# Altium schematic sheet new_controller.SchDoc
size A2
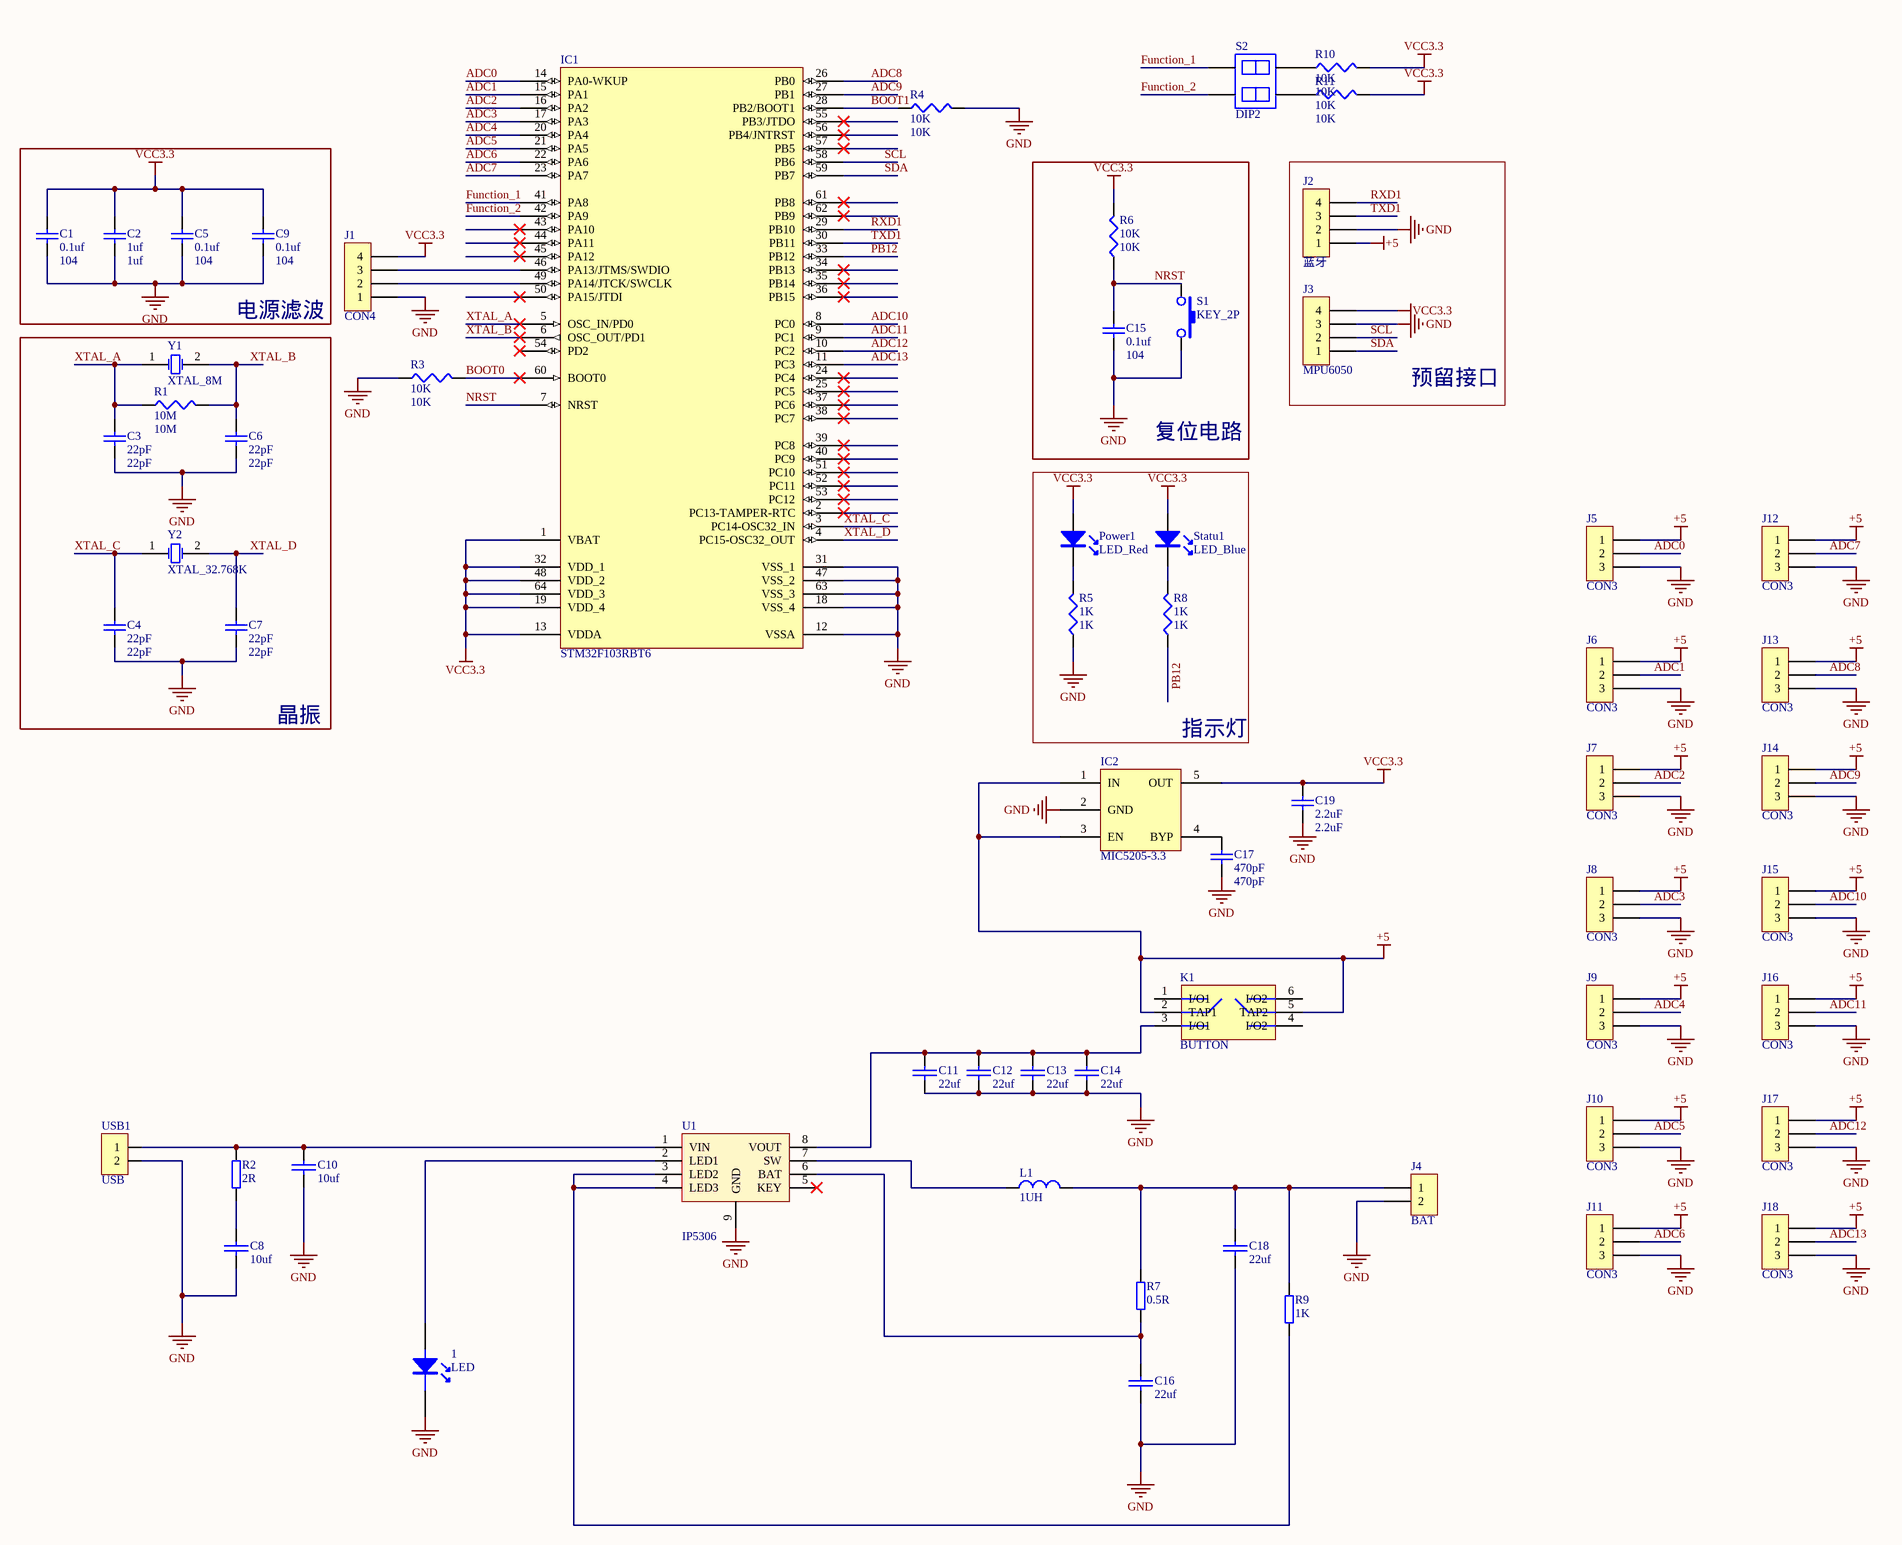
[diagram p0: new_controller.SchDoc]

## Parts
1  LED  [6-0805_L]
C1  0.1uf  value 104  [6-0805_L]
C2  1uf  [6-0805_L]
C3  22pF  [6-0805_L]
C4  22pF  [6-0805_L]
C5  0.1uf  value 104  [6-0805_L]
C6  22pF  [6-0805_L]
C7  22pF  [6-0805_L]
C8  10uf  [6-0805_L]
C9  0.1uf  value 104  [6-0805_L]
C10  10uf  [6-0805_L]
C11  22uf  [6-0805_L]
C12  22uf  [6-0805_L]
C13  22uf  [6-0805_L]
C14  22uf  [6-0805_L]
C15  0.1uf  value 104  [6-0805_L]
C16  22uf  [6-0805_L]
C17  470pF  [6-0805_L]
C18  22uf  [6-0805_L]
C19  2.2uF  [6-0805_L]
IC1  STM32F103RBT6  [LQFP64_N]
IC2  MIC5205-3.3  [SOT-23-5]
J1  CON4  [HDR1X4]
J2  蓝牙  [HDR1X4]
J3  MPU6050  [HDR1X4]
J4  BAT  [接线座2P]
J5  CON3  [XH2.54-3P]
J6  CON3  [XH2.54-3P]
J7  CON3  [XH2.54-3P]
J8  CON3  [XH2.54-3P]
J9  CON3  [XH2.54-3P]
J10  CON3  [XH2.54-3P]
J11  CON3  [XH2.54-3P]
J12  CON3  [XH2.54-3P]
J13  CON3  [XH2.54-3P]
J14  CON3  [XH2.54-3P]
J15  CON3  [XH2.54-3P]
J16  CON3  [XH2.54-3P]
J17  CON3  [XH2.54-3P]
J18  CON3  [XH2.54-3P]
K1  BUTTON  [switch]
L1  1UH  [0630电感]
Power1  LED_Red  [6-0805_M]
R1  10M  [6-0805_L]
R2  2R  [6-0805_L]
R3  10K  [6-0805_L]
R4  10K  [6-0805_L]
R5  1K  [6-0805_L]
R6  10K  [6-0805_L]
R7  0.5R  [6-0805_L]
R8  1K  [6-0805_L]
R9  1K  [6-0805_L]
R10  10K  [6-0805_L]
R11  10K  [6-0805_L]
S1  KEY_2P  [button]
S2  DIP2  [DIP2]
Statu1  LED_Blue  [6-0805_M]
U1  IP5306  [ESOP8]
USB1  USB  [Type-C]
Y1  XTAL_8M  [xtal]
Y2  XTAL_32.768K  [R38]

## Blocks framed on the sheet
电源滤波: C1 C2 C5 C9
复位电路: C15 R6 S1
预留接口: J2 J3
晶振: C3 C4 C6 C7 R1 Y1 Y2
指示灯: Power1 R5 R8 Statu1

## Nets
+5: IC2.1(IN) IC2.3(EN) J2.1 J5.1 J6.1 J7.1 J8.1 J9.1 J10.1 J11.1 J12.1 J13.1 J14.1 J15.1 J16.1 J17.1 J18.1 K1.2(TAP1) K1.5(TAP2)
GND: 1.K C1.1 C2.1 C3.1 C4.1 C5.1 C6.1 C7.1 C8.2 C9.1 C10.2 C11.2 C12.2 C13.2 C14.2 C15.1 C16.2 C17.1 C18.2 C19.1 IC1.12(VSSA) IC1.18(VSS_4) IC1.31(VSS_1) IC1.47(VSS_2) IC1.63(VSS_3) IC2.2(GND) J1.1 J2.2 J3.3 J4.2 J5.3 J6.3 J7.3 J8.3 J9.3 J10.3 J11.3 J12.3 J13.3 J14.3 J15.3 J16.3 J17.3 J18.3 R3.1 R4.2 R5.1 S1.2 U1.9(GND) USB1.2
VCC3.3: C1.2 C2.2 C5.2 C9.2 C19.2 IC1.1(VBAT) IC1.13(VDDA) IC1.19(VDD_4) IC1.32(VDD_1) IC1.48(VDD_2) IC1.64(VDD_3) IC2.5(OUT) J1.4 J3.4 Power1.1 R6.2 R10.2 R11.2 Statu1.1
ADC0: IC1.14(PA0-WKUP) J5.2
ADC1: IC1.15(PA1) J6.2
ADC2: IC1.16(PA2) J7.2
ADC3: IC1.17(PA3) J8.2
ADC4: IC1.20(PA4) J9.2
ADC5: IC1.21(PA5) J10.2
ADC6: IC1.22(PA6) J11.2
ADC7: IC1.23(PA7) J12.2
ADC8: IC1.26(PB0) J13.2
ADC9: IC1.27(PB1) J14.2
ADC10: IC1.8(PC0) J15.2
ADC11: IC1.9(PC1) J16.2
ADC12: IC1.10(PC2) J17.2
ADC13: IC1.11(PC3) J18.2
BOOT0: IC1.60(BOOT0) R3.2
BOOT1: IC1.28(PB2/BOOT1) R4.1
Function_1: IC1.41(PA8) S2.1
Function_2: IC1.42(PA9) S2.2
NRST: C15.2 IC1.7(NRST) R6.1 S1.1
PB12: IC1.33(PB12) R8.1
RXD1: IC1.29(PB10) J2.4
SCL: IC1.58(PB6) J3.2
SDA: IC1.59(PB7) J3.1
TXD1: IC1.30(PB11) J2.3
XTAL_A: C3.2 IC1.5(OSC_IN/PD0) R1.1 Y1.1(OSC1)
XTAL_B: C6.2 IC1.6(OSC_OUT/PD1) R1.2 Y1.2(OSC2)
XTAL_C: C4.2 IC1.3(PC14-OSC32_IN) Y2.1(OSC1)
XTAL_D: C7.2 IC1.4(PC15-OSC32_OUT) Y2.2(OSC2)
Net1_A: 1.A U1.2(LED1)
NetC8_1: C8.1 R2.1
NetC10_1: C10.1 R2.2 U1.1(VIN) USB1.1
NetC11_1: C11.1 C12.1 C13.1 C14.1 K1.3(I/O1) U1.8(VOUT)
NetC16_1: C16.1 R7.2 U1.6(BAT)
NetC17_2: C17.2 IC2.4(BYP)
NetC18_1: C18.1 J4.1 L1.2 R7.1 R9.1
NetIC1_46: IC1.46(PA13/JTMS/SWDIO) J1.3
NetIC1_49: IC1.49(PA14/JTCK/SWCLK) J1.2
NetL1_1: L1.1 U1.7(SW)
NetPower1_2: Power1.2 R5.2
NetR8_2: R8.2 Statu1.2
NetR9_2: R9.2 U1.3(LED2) U1.4(LED3)
NetR10_1: R10.1 S2.3
NetR11_1: R11.1 S2.4

Not connected (* = marked no-connect by the designer): IC1 2(PC13-TAMPER-RTC)* 24(PC4)* 25(PC5)* 34(PB13)* 35(PB14)* 36(PB15)* 37(PC6)* 38(PC7)* 39(PC8)* 40(PC9)* 43(PA10)* 44(PA11)* 45(PA12)* 50(PA15/JTDI)* 51(PC10)* 52(PC11)* 53(PC12)* 54(PD2)* 55(PB3/JTDO)* 56(PB4/JNTRST)* 57(PB5)* 61(PB8)* 62(PB9)*; K1 1(I/O1) 4(I/O2) 6(I/O2); U1 5(KEY)*

## Notes on the sheet
- Title
- Size:
- Date:
- File:
- A2
- Number:
- Time:
- Revision:
- Sheet
- of

## Library data of the parts
1 = LED: pin to pad: A>1 K>2
C1-C7 C9 C15 C17 C19 = Cap Semi: Capacitor (Semiconductor SIM Model); Published: 8-Jun-2000; LatestRevisionDate: 29-May-2009; LatestRevisionNote: IPC-7351 Footprint Added.; PackageReference: C1206; Publisher: Altium Limited; PackageDescription: Chip Capacitor
  C2: Value: 1uf
  C3 C4 C6 C7: Value: 22pF
  C17: Value: 470pF
  C19: Value: 2.2uF
C8 C10-C14 C16 C18 = CAP: 电容
IC1 = STM32F103RBT6: STM32 ARM-based 32-bit MCU with 128 Kbytes Flash, 64-pin LQFP, Industrial Temperature; Published: 30-May-2008; DatasheetVersion: rev6, Mar-2008; PackageVersion: Mar-2008; PackageReference: LQFP64; Publisher: Altium Limited; PackageDescription: 64-Pin Low-Profile Quad Flat Pack, 10 x 10 mm Body, 0.5 mm Pitch (LQFP64); ComponentLink1Description: Manufacturer Link; ComponentLink1URL: www.st.com/stm32; ComponentLink2Description: Datasheet; ComponentLink2URL: http://www.st.com/stonline/products/literature/ds/13587.pdf
IC2 = MIC5205-3.3: 稳压
J1 = CON4: 连接器
J2 J3 = CON4: Connector
J4 = CON2: 连接器
J5-J18 = CON3: 连接器
K1 = BUTTON: 自锁按键
L1 = Inductor: 电感
Power1 Statu1 = LED
R1 R3-R6 R8 R10 R11 = Res3: Resistor; Published: 8-Jun-2000; LatestRevisionDate: 29-May-2009; LatestRevisionNote: IPC-7351 Footprint Added.; PackageReference: J1-0603; Publisher: Altium Limited; PackageDescription: Chip Resistor
  R1: Value: 10M
  R3 R4 R6 R10 R11: Value: 10K
  R5 R8: Value: 1K
R2 R7 R9 = RES: 电阻
S1 = KEY_2P: 轻触按键2P
S2 = 拨码开关2DIP
USB1 = CON2: Conjunctor
Y1 Y2 = XTAL: Crystal Oscillator; Published: 8-Jun-2000; LatestRevisionDate: 17-Jul-2002; LatestRevisionNote: Re-released for DXP Platform.; PackageReference: R38; Publisher: Altium Limited; PackageDescription: Crystal, Thru-Hole; 2 Leads; Body 3.1 x 8.2 mm (Dia.xH)